# Altium schematic sheet Knee Ratio.SchDoc
size Letter; SheetNumber: 10; SheetTotal: 14
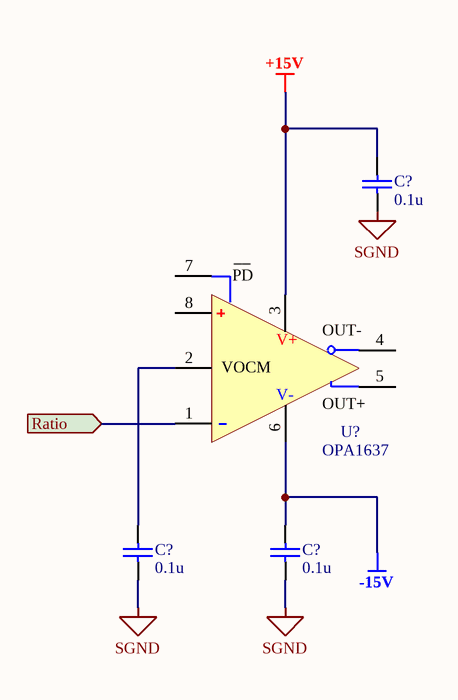
[diagram p0: Knee Ratio.SchDoc]

## Parts
(Parts that share a designator on the sheet are numbered #1, #2 ... from top to bottom, then left to right.)
C?#1  value 0.1u  (hidden comment: Capacitor)
C?#2  value 0.1u  (hidden comment: Capacitor)
C?#3  value 0.1u  (hidden comment: Capacitor)
U?  OPA1637  [FP-DGK0008A-IPC_A]

## Ports
Ratio (in)

## Nets
+15V: C?#1.2 U?.3(VS+)
-15V: C?#3.2 U?.6(VS-)
SGND: C?#1.1 C?#2.1 C?#3.1
Ratio: U?.1(IN-) ; port Ratio
NetC?#2_2: C?#2.2 U?.2(VOCM)

Not connected (* = marked no-connect by the designer): U? 4(OUT+) 5(OUT-) 7(~{PD}) 8(IN+)

## Notes on the sheet
- (in symbol OPA1637DGKT) __; PD; V+; V-

## Library data of the parts
C?#1-C?#3 = Capacitor: SimulationGenericComponent: True
U? = OPA1637DGKT: Fully differential amplifier